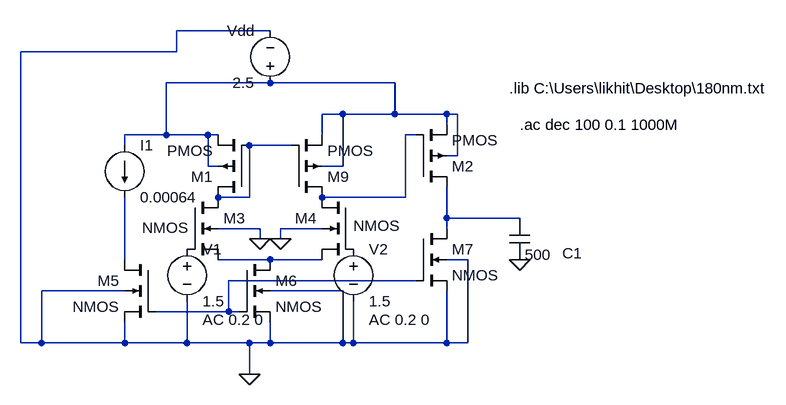
[diagram p0: schematic ADVD_test.asc]
ADVD_test.asc, the LTspice schematic file:
Version 4
SHEET 1 1008 680
WIRE 160 -112 16 -112
WIRE 16 -80 16 -112
WIRE 16 -80 -224 -80
WIRE 160 -32 0 -32
WIRE 352 -32 160 -32
WIRE 272 16 240 16
WIRE 352 16 352 -32
WIRE 352 16 272 16
WIRE 432 16 352 16
WIRE 448 16 432 16
WIRE 432 32 432 16
WIRE 0 48 0 -32
WIRE 0 48 -64 48
WIRE 64 48 0 48
WIRE 80 48 64 48
WIRE 240 48 240 16
WIRE 384 48 368 48
WIRE -64 64 -64 48
WIRE 192 64 128 64
WIRE 448 80 448 16
WIRE 448 80 432 80
WIRE 64 96 64 48
WIRE 80 96 64 96
WIRE 272 96 272 16
WIRE 272 96 240 96
WIRE 128 144 128 64
WIRE 128 144 80 144
WIRE 368 144 368 48
WIRE 368 144 240 144
WIRE 432 176 432 128
WIRE 544 176 432 176
WIRE 144 192 80 192
WIRE 240 192 176 192
WIRE 432 192 432 176
WIRE 144 208 144 192
WIRE 176 208 176 192
WIRE -64 240 -64 144
WIRE 160 240 80 240
WIRE 240 240 160 240
WIRE 464 240 432 240
WIRE 384 272 96 272
WIRE -64 288 -192 288
WIRE 272 288 160 288
WIRE 96 320 96 272
WIRE 96 320 -16 320
WIRE 112 320 96 320
WIRE -224 368 -224 -80
WIRE -192 368 -192 288
WIRE -192 368 -224 368
WIRE -64 368 -64 336
WIRE -64 368 -192 368
WIRE 32 368 32 304
WIRE 32 368 -64 368
WIRE 128 368 32 368
WIRE 160 368 160 336
WIRE 160 368 128 368
WIRE 272 368 272 288
WIRE 272 368 160 368
WIRE 288 368 288 304
WIRE 288 368 272 368
WIRE 432 368 432 288
WIRE 432 368 288 368
WIRE 464 368 464 240
WIRE 464 368 432 368
WIRE 128 416 128 368
FLAG 544 240 0
FLAG 144 208 0
FLAG 176 208 0
FLAG 128 416 0
SYMBOL cap 528 176 R0
WINDOW 0 82 54 Left 2
SYMATTR InstName C1
SYMATTR Value 500
SYMBOL current -64 64 R0
WINDOW 123 0 0 Left 2
WINDOW 39 0 0 Left 2
SYMATTR InstName I1
SYMATTR Value 0.00064
SYMBOL pmos4 128 144 R180
SYMATTR InstName M1
SYMATTR Value2 l=90u w=1u
SYMBOL pmos4 192 144 M180
SYMATTR InstName M9
SYMATTR Value2 l=90u w=1u
SYMBOL pmos4 384 128 M180
SYMATTR InstName M2
SYMATTR Value2 l=124u w=0.8618u
SYMBOL nmos4 32 144 R0
WINDOW 3 -69 47 Left 2
SYMATTR InstName M3
SYMATTR Value2 l=135u w=1u
SYMBOL nmos4 288 144 M0
WINDOW 3 -72 44 Left 2
SYMATTR InstName M4
SYMATTR Value2 l=135u w=1u
SYMBOL nmos4 -16 240 M0
SYMATTR InstName M5
SYMATTR Value2 l=160u w=1u
SYMBOL nmos4 112 240 R0
SYMATTR InstName M6
SYMATTR Value2 l=45u w=1u
SYMBOL nmos4 384 192 R0
SYMATTR InstName M7
SYMATTR Value2 l=31u w=0.8618u
SYMBOL voltage 32 208 R0
WINDOW 123 24 124 Left 2
WINDOW 39 0 0 Left 2
SYMATTR InstName V1
SYMATTR Value 1.5
SYMATTR Value2 AC 0.2 0
SYMBOL voltage 288 208 R0
WINDOW 123 24 124 Left 2
WINDOW 39 0 0 Left 2
SYMATTR InstName V2
SYMATTR Value 1.5
SYMATTR Value2 AC 0.2 0
SYMBOL voltage 160 -16 R180
WINDOW 0 24 96 Left 2
WINDOW 3 24 16 Left 2
SYMATTR InstName Vdd
SYMATTR Value 2.5
TEXT 528 -24 Left 2 !.lib C:\\Users\\likhit\\Desktop\\180nm.txt
TEXT 544 32 Left 2 !.ac dec 100 0.1 1000M

The netlist it stands for:
* ADVD_test.asc
C1 N004 0 500
I1 N001 N005 0.00064
M1 N003 N003 N001 N001 PMOS l=90u w=1u
M9 N002 N003 N001 N001 PMOS l=90u w=1u
M2 N004 N002 N001 N001 PMOS l=124u w=0.8618u
M3 N003 P001 N006 0 NMOS l=135u w=1u
M4 N002 P002 N006 0 NMOS l=135u w=1u
M5 N005 N007 0 0 NMOS l=160u w=1u
M6 N006 N007 0 0 NMOS l=45u w=1u
M7 N004 N007 0 0 NMOS l=31u w=0.8618u
V1 P001 0 1.5 AC 0.2 0
V2 P002 0 1.5 AC 0.2 0
Vdd N001 0 2.5
.model NMOS NMOS
.model PMOS PMOS
.lib standard.mos
.lib C:\Users\likhit\Desktop\180nm.txt
.ac dec 100 0.1 1000M
.backanno
.end